# EAGLE schematic telemetryPackage (EAGLE 9.6.2)
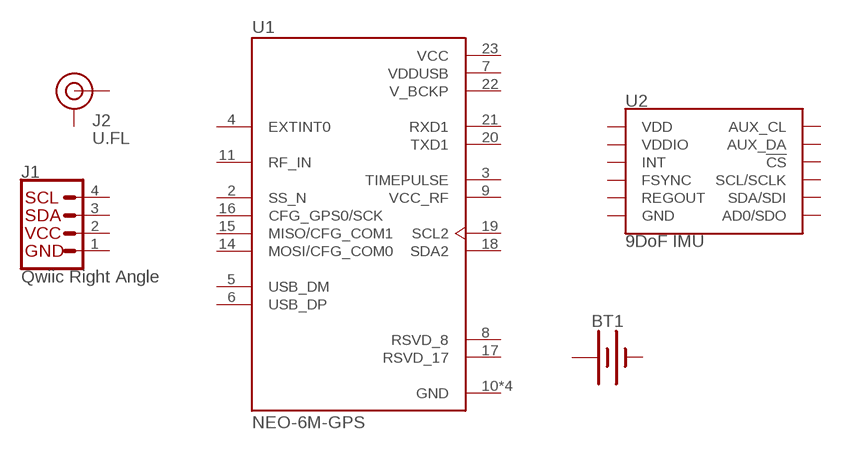
[diagram p0: schematic, sheet 1]

## Parts
BT1  BATTERY-20MM_SMD_4LEGS_OVERPASTE_INNER  [BATTCON_20MM_4LEGS_OVERPASTE_INNER]
J1  Qwiic Right Angle  I2C_STANDARDQWIIC  [JST04_1MM_RA]
J2  U.FL  U.FL2PIN  [U.FL]
U1  NEO-6M-GPS  [XCVR_NEO-6M-GPS]
U2  9DoF IMU  ICM-20948  [QFN24-3X3]
Unconnected: J1.3 J1.4 J2.1(GND) J2.2(GND) J2.FEED(SIGNAL) U1.2(SS_N) U1.3(TIMEPULSE) U1.4(EXTINT0) U1.5(USB_DM) U1.6(USB_DP) U1.8(RSVD_8) U1.9(VCC_RF) U1.11(RF_IN) U1.14(MOSI/CFG_COM0) U1.15(MISO/CFG_COM1) U1.16(CFG_GPS0/SCK) U1.17(RSVD_17) U1.18(SDA2) U1.19(SCL2) U1.20(TXD1) U1.21(RXD1) U2.7(AUX_CL) U2.8(VDDIO) U2.9(AD0/SDO) U2.10(REGOUT) U2.11(FSYNC) U2.12(INT) U2.13(VDD) U2.18(GND) U2.20(GND) U2.21(AUX_DA) U2.22(!CS) U2.23(SCL/SCLK) U2.24(SDA/SDI)

## Power pins joined to a net without a drawn wire
1: J1.1
2: J1.2
+: BT1.1(+)
-: BT1.2(-)
GND: U1.10(GND) U1.12(GND) U1.13(GND) U1.24(GND)
V_BCKP: U1.22(V_BCKP)
VCC: U1.23(VCC)
VDDUSB: U1.7(VDDUSB)

## Library data of the parts
BT1 = SparkFun-Batteries:BATTERY: Battery - Single Cell A variety of battery chemistries, sizes, and footprints. Device List: 20MM_PTH - Coin Cell Battery Holder - 20mm (PTH) <https://www.sparkfun.com/products/783> 20MM_PTH_KIT- Coin Cell battery Holder - 20 mm (PTH) <http://www.sparkfun.com/products/783>kit version with special mask 6.8MM_PTH - Coin Cell Battery Holder - 6.8MM(SMD) <https://www.digikey.com/product-detail/en/seiko-instruments/MS621FE-FL11E/728-1057-ND/1889208?WT.srch=1&gclid=CNOQ5a6LzdQCFZS2wAodXCkE0g> 12MM_SMD - Coin Cell Battery Holder - 12mm (SMD) <https://www.sparkfun.com/products/10592> 12MM_PTH - Coin Cell Battery Holder - 12mm (PTH) <https://www.sparkfun.com/products/7948> 20MM_SMD - 20mm Coin Cell Battery Holder (SMD) (2 legs) Used on the Big Time Watch Kit <https://www.sparkfun.com/products/11734> 20MM_SMD_4LEGS - Coin Cell Battery Holder - 20mm (SMD) <https://www.sparkfun.com/products/11892> 20MM_SMD_4LEGS_OVERPASTE - Coin Cell Battery Holder - 20mm (SMD) <https://www.sparkfun.com/products/11892> (Over-paste on the legs) 24.5MM_PTH - Coin Cell Battery Holder - 24.5mm (PTH) <https://www.sparkfun.com/products/8863> 9V - 9V Battery Holder - PC Mount Used on the SparkFun SparkPunk Sound Kit <https://www.sparkfun.com/products/11177> and SparkFun SparkPunk Sequencer Kit <https://www.sparkfun.com/products/12707> 18650 - Battery Holder - 18650 (PTH) <https://www.sparkfun.com/products/13113> AA - Battery Holder - 1xAA (PTH) <https://www.sparkfun.com/products/7949> AAA - Battery Holder - 1xAAA (PTH) <https://www.sparkfun.com/products/12718> AA_KIT - Battery Holder - 1xAA (PTH) <https://www.sparkfun.com/products/7949> Special kit package - pads only have exposed copper on one side of the board. AAA_KIT - Battery Holder - 1xAAA (PTH) <https://www.sparkfun.com/products/12718> Special kit package - pads only have exposed copper on one side of the board.
J1 = SparkFun-Connectors:I2C_STANDARD: SparkFun I2C Standard Pinout Header SparkFun has standardized on a pinout for all I2C based sensor breakouts. This pinout allows I2C boards to be plugged directly into the headers on Arduino Uno compatible boards, and to be daisy chained easily. Example SparkFun Products: SparkFun Atmospheric Sensor Breakout - BME280 <https://www.sparkfun.com/products/13676> SparkFun Altitude/Pressure Sensor Breakout - MPL3115A2 <https://www.sparkfun.com/products/11084> SparkFun TOF Range Finder Sensor - VL6180 <https://www.sparkfun.com/products/12785>; PROD_ID: CONN-13694
J2 = SparkFun-Connectors:U.FL2PIN: SMD Antenna Connector - U.FL 2mm height, 3.0mm x 3.0mm receptacle size. SparkFun Products: SparkFun WiFi Shield - ESP8266 <https://www.sparkfun.com/products/13287> SparkFun ESP8266 Thing <https://www.sparkfun.com/products/13231> SparkFun MiniGen - Pro Mini Signal Generator Shield <https://www.sparkfun.com/products/11420>; PROD_ID: CONN-09193; SF_ID: WRL-09144
U1 = NEO-6M-GPS:NEO-6M-GPS: SMD GPS Module Check availability <https://pricing.snapeda.com/parts/NEO-6M-GPS/u-blox/view-part?ref=eda>; AVAILABILITY: Not in stock; DESCRIPTION: GPS Development Tools SparkFun GNSS-RTK Dead Reckoning Breakout - ZED-F9K (Qwiic); MF: u-blox; MP: NEO-6M-GPS; PACKAGE: None; PRICE: None
U2 = SparkFun-Sensors:ICM-20948: ICM-20948 9 Degree of Freedom IMU World’s lowest power 9-axis MotionTracking device that is ideally suited for smartphones, tablets, wearable sensors, and IoT applications. Includes onboard Digital Motion Processor to offload computations from the host processor Datasheet <https://cdn.sparkfun.com/assets/learn_tutorials/5/5/0/MPU9250REV1.0.pdf> SparkFun Products: SparkFun IMU Breakout - ICM-20948 <https://www.sparkfun.com/products/15182>; PROD_ID: IC-14247